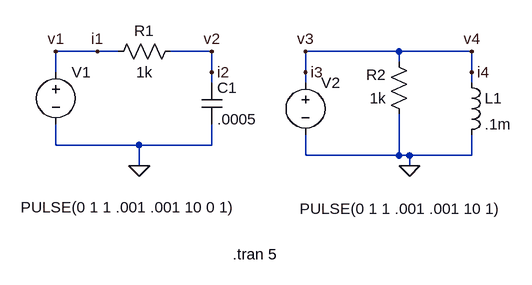
[diagram p0: schematic 0_FirstOrderReactiveCircuit.asc]
0_FirstOrderReactiveCircuit.asc, the LTspice schematic file:
Version 4
SHEET 1 1480 680
WIRE 240 96 176 96
WIRE 272 96 240 96
WIRE 416 96 352 96
WIRE 704 96 560 96
WIRE 816 96 704 96
WIRE 704 112 704 96
WIRE 176 128 176 96
WIRE 416 128 416 96
WIRE 560 128 560 96
WIRE 816 128 816 96
WIRE 416 144 416 128
WIRE 560 144 560 128
WIRE 816 144 816 128
WIRE 176 240 176 208
WIRE 304 240 176 240
WIRE 416 240 416 208
WIRE 416 240 304 240
WIRE 560 256 560 224
WIRE 704 256 704 192
WIRE 704 256 560 256
WIRE 720 256 704 256
WIRE 816 256 816 224
WIRE 816 256 720 256
WIRE 304 272 304 240
WIRE 720 272 720 256
FLAG 304 272 0
FLAG 720 272 0
FLAG 176 96 v1
FLAG 416 96 v2
FLAG 560 96 v3
FLAG 816 96 v4
FLAG 416 128 i2
FLAG 816 128 i4
FLAG 560 128 i3
FLAG 240 96 i1
SYMBOL voltage 176 112 R0
WINDOW 3 -54 224 Left 2
WINDOW 123 0 0 Left 0
WINDOW 39 0 0 Left 0
SYMATTR InstName V1
SYMATTR Value PULSE(0 1 1 .001 .001 10 0 1)
SYMBOL res 368 80 R90
WINDOW 0 0 56 VBottom 2
WINDOW 3 32 56 VTop 2
SYMATTR InstName R1
SYMATTR Value 1k
SYMBOL cap 400 144 R0
SYMATTR InstName C1
SYMATTR Value .0005
SYMBOL voltage 560 128 R0
WINDOW 3 -9 210 Left 2
WINDOW 123 0 0 Left 0
WINDOW 39 0 0 Left 0
SYMATTR InstName V2
SYMATTR Value PULSE(0 1 1 .001 .001 10 1)
SYMBOL res 720 208 R180
WINDOW 0 36 76 Left 2
WINDOW 3 36 40 Left 2
SYMATTR InstName R2
SYMATTR Value 1k
SYMBOL ind 800 128 R0
SYMATTR InstName L1
SYMATTR Value .1m
TEXT 448 408 Left 2 !.tran 5

The netlist it stands for:
* 0_FirstOrderReactiveCircuit.asc
V1 i1 0 PULSE(0 1 1 .001 .001 10 0 1)
R1 i2 i1 1k
C1 i2 0 .0005
V2 i3 0 PULSE(0 1 1 .001 .001 10 1)
R2 0 i3 1k
L1 i3 0 .1m
.tran 5
.backanno
.end